# EAGLE schematic AuxilaryWiring (EAGLE 7.6.0)
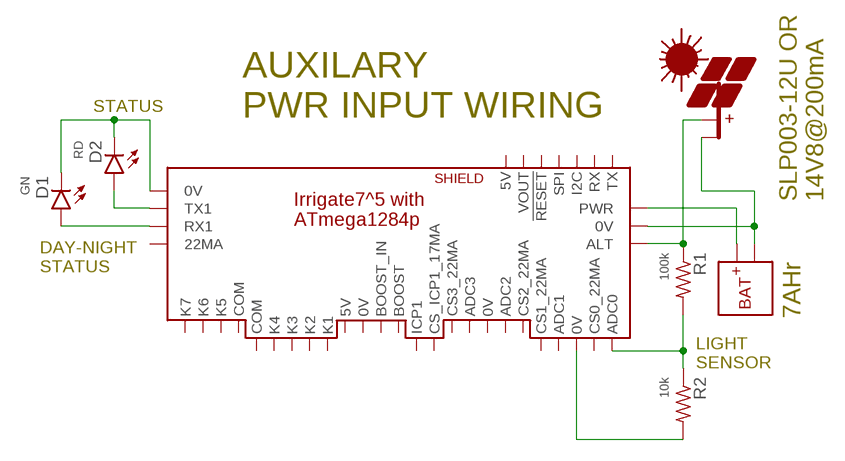
[diagram p0: schematic, sheet 1]

## Parts
D1  GN  LED5MM  [LED5MM]
D2  RD  LED5MM  [LED5MM]
PV4  PV  [NA-30]
R1  100k  R0805  [C0805(2012)]
R2  10k  R0805  [C0805(2012)]
U$1  IRRIGATE7  [WITH_RPU_NAMES]
U$7  BAT  [NA-30]

## Nets
N$1: D1.A U$1.DIO2(RX1)
N$2: D1.K D2.K U$1.17MA@ICP3(0V)
N$3: D2.A U$1.DIO3(TX1)
N$4: R1.2 R2.1 U$1.ADC0
N$5: R2.2 U$1.0V@ADC2(0V)
N$15: U$1.PWR U$7.1(+BAT)
N$42: PV4.2(-PV) U$1.0V@PWR(0V) U$7.2(-BAT)
N$50: PV4.1(+PV) R1.1 U$1.AUX(ALT)
Unconnected: U$1.0V U$1.5V U$1.17MA@ICP1(CS_ICP1_17MA) U$1.22MA@ADC0(CS0_22MA) U$1.22MA@ADC1(CS1_22MA) U$1.22MA@ADC4(CS2_22MA) U$1.22MA@ADC5(CS3_22MA) U$1.22MA@DIO2(22MA) U$1.!RESET U$1.ADC1 U$1.ADC4(ADC2) U$1.ADC5(ADC3) U$1.BOOST U$1.BOOST_IN U$1.COM@K4(COM) U$1.COM@K5(COM) U$1.I2C U$1.ICP1 U$1.ICP3(0V) U$1.K1 U$1.K2 U$1.K3 U$1.K4 U$1.K5 U$1.K6 U$1.K7 U$1.RX U$1.SHLD_5V(5V) U$1.SHLD_VOUT(VOUT) U$1.SPI U$1.TX

## Notes on the sheet
- STATUS
- AUXILARY 
  PWR INPUT WIRING
- SLP003-12U OR
  14V8@200mA
- DAY-NIGHT
  STATUS
- 7AHr
- LIGHT
  SENSOR

## Library data of the parts
D1 D2 = D-LED:LED: LED 120120WH [CREE,XHGAWT-00-0000-00000HXE1] LED WHITE 6500K 150LUM-W120120
PV4 = Documentation:PV
R1 R2 = R-C:R: Resiistor American-style symbol
U$1 = Documentation:IRRIGATE7: BM /w 1284p
U$7 = Documentation:BAT